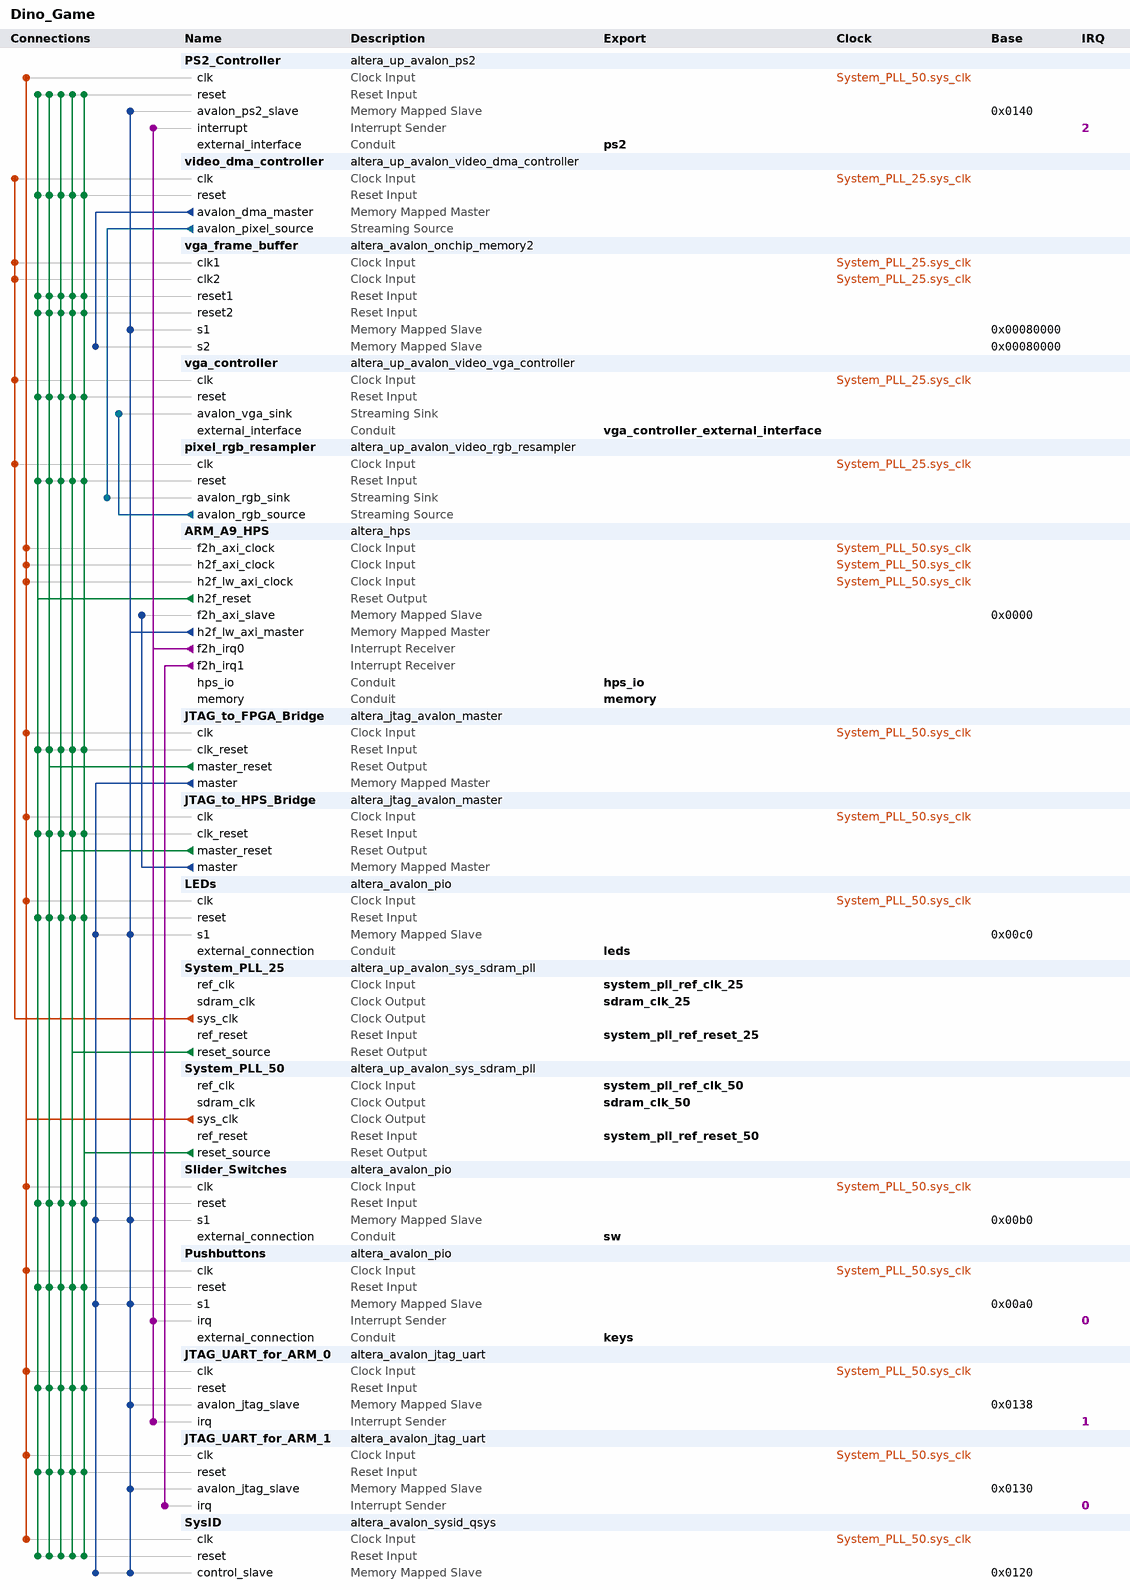
[diagram p0: system contents]
# Platform Designer (Qsys) system Dino_Game, Cyclone V 5CSEMA5F31C6
# Parameters at their usual value, and those the tool derives, are not listed.
package require -exact qsys 22.1
create_system Dino_Game
set_project_property DEVICE_FAMILY {Cyclone V}
set_project_property DEVICE 5CSEMA5F31C6

add_instance PS2_Controller altera_up_avalon_ps2 18.0

add_instance video_dma_controller altera_up_avalon_video_dma_controller 18.0
set_instance_parameter_value video_dma_controller addr_mode X-Y
set_instance_parameter_value video_dma_controller back_start_address 0
set_instance_parameter_value video_dma_controller color_bits 8
set_instance_parameter_value video_dma_controller color_planes 1
set_instance_parameter_value video_dma_controller dma_enabled true
set_instance_parameter_value video_dma_controller height 480
set_instance_parameter_value video_dma_controller mode {From Memory to Stream}
set_instance_parameter_value video_dma_controller start_address 0
set_instance_parameter_value video_dma_controller width 640

add_instance vga_frame_buffer altera_avalon_onchip_memory2 22.1
set_instance_parameter_value vga_frame_buffer dataWidth 8
set_instance_parameter_value vga_frame_buffer dualPort true
set_instance_parameter_value vga_frame_buffer initMemContent true
set_instance_parameter_value vga_frame_buffer initializationFileName vga_frame_buffer
set_instance_parameter_value vga_frame_buffer memorySize 307200

add_instance vga_controller altera_up_avalon_video_vga_controller 21.1
set_instance_parameter_value vga_controller board DE1-SoC
set_instance_parameter_value vga_controller resolution {VGA 640x480}

add_instance pixel_rgb_resampler altera_up_avalon_video_rgb_resampler 18.0
set_instance_parameter_value pixel_rgb_resampler alpha 1023
set_instance_parameter_value pixel_rgb_resampler input_type {8-bit RGB}
set_instance_parameter_value pixel_rgb_resampler output_type {30-bit RGB}

add_instance ARM_A9_HPS altera_hps 22.1
set_instance_parameter_value ARM_A9_HPS EMAC1_Mode RGMII
set_instance_parameter_value ARM_A9_HPS EMAC1_PinMuxing {HPS I/O Set 0}
set_instance_parameter_value ARM_A9_HPS F2SCLK_COLDRST_Enable false
set_instance_parameter_value ARM_A9_HPS F2SCLK_DBGRST_Enable false
set_instance_parameter_value ARM_A9_HPS F2SCLK_WARMRST_Enable false
set_instance_parameter_value ARM_A9_HPS F2SINTERRUPT_Enable true
set_instance_parameter_value ARM_A9_HPS F2S_Width 2
set_instance_parameter_value ARM_A9_HPS FPGA_PERIPHERAL_OUTPUT_CLOCK_FREQ_EMAC0_GTX_CLK 100
set_instance_parameter_value ARM_A9_HPS FPGA_PERIPHERAL_OUTPUT_CLOCK_FREQ_EMAC0_MD_CLK 100.0
set_instance_parameter_value ARM_A9_HPS FPGA_PERIPHERAL_OUTPUT_CLOCK_FREQ_EMAC1_GTX_CLK 100
set_instance_parameter_value ARM_A9_HPS FPGA_PERIPHERAL_OUTPUT_CLOCK_FREQ_EMAC1_MD_CLK 100.0
set_instance_parameter_value ARM_A9_HPS HPS_PROTOCOL DDR3
set_instance_parameter_value ARM_A9_HPS I2C0_Mode I2C
set_instance_parameter_value ARM_A9_HPS I2C0_PinMuxing {HPS I/O Set 0}
set_instance_parameter_value ARM_A9_HPS I2C1_Mode I2C
set_instance_parameter_value ARM_A9_HPS I2C1_PinMuxing {HPS I/O Set 0}
set_instance_parameter_value ARM_A9_HPS LWH2F_Enable true
set_instance_parameter_value ARM_A9_HPS MEM_BANKADDR_WIDTH 3
set_instance_parameter_value ARM_A9_HPS MEM_CLK_FREQ 400.0
set_instance_parameter_value ARM_A9_HPS MEM_COL_ADDR_WIDTH 10
set_instance_parameter_value ARM_A9_HPS MEM_DQ_WIDTH 32
set_instance_parameter_value ARM_A9_HPS MEM_DRV_STR RZQ/6
set_instance_parameter_value ARM_A9_HPS MEM_ROW_ADDR_WIDTH 15
set_instance_parameter_value ARM_A9_HPS MEM_RTT_NOM RZQ/6
set_instance_parameter_value ARM_A9_HPS MEM_RTT_WR {Dynamic ODT off}
set_instance_parameter_value ARM_A9_HPS MEM_TCL 7
set_instance_parameter_value ARM_A9_HPS MEM_TFAW_NS 45.0
set_instance_parameter_value ARM_A9_HPS MEM_TRAS_NS 36.0
set_instance_parameter_value ARM_A9_HPS MEM_TRCD_NS 13.125
set_instance_parameter_value ARM_A9_HPS MEM_TRFC_NS 300.0
set_instance_parameter_value ARM_A9_HPS MEM_TRP_NS 13.125
set_instance_parameter_value ARM_A9_HPS MEM_VENDOR Micron
set_instance_parameter_value ARM_A9_HPS MEM_WTCL 7
set_instance_parameter_value ARM_A9_HPS QSPI_Mode {1 SS}
set_instance_parameter_value ARM_A9_HPS QSPI_PinMuxing {HPS I/O Set 0}
set_instance_parameter_value ARM_A9_HPS REF_CLK_FREQ 25.0
set_instance_parameter_value ARM_A9_HPS S2FCLK_USER2CLK 5
set_instance_parameter_value ARM_A9_HPS S2F_Width 3
set_instance_parameter_value ARM_A9_HPS SDIO_Mode {4-bit Data}
set_instance_parameter_value ARM_A9_HPS SDIO_PinMuxing {HPS I/O Set 0}
set_instance_parameter_value ARM_A9_HPS SPIM1_Mode {Single Slave Select}
set_instance_parameter_value ARM_A9_HPS SPIM1_PinMuxing {HPS I/O Set 0}
set_instance_parameter_value ARM_A9_HPS STM_Enable true
set_instance_parameter_value ARM_A9_HPS TIMING_BOARD_AC_SKEW 0.02
set_instance_parameter_value ARM_A9_HPS TIMING_BOARD_AC_TO_CK_SKEW 0.01
set_instance_parameter_value ARM_A9_HPS TIMING_BOARD_DQ_TO_DQS_SKEW 0.05
set_instance_parameter_value ARM_A9_HPS TIMING_BOARD_MAX_CK_DELAY 0.03
set_instance_parameter_value ARM_A9_HPS TIMING_BOARD_MAX_DQS_DELAY 0.02
set_instance_parameter_value ARM_A9_HPS TIMING_BOARD_SKEW_BETWEEN_DQS 0.06
set_instance_parameter_value ARM_A9_HPS TIMING_BOARD_SKEW_CKDQS_DIMM_MAX 0.12
set_instance_parameter_value ARM_A9_HPS TIMING_BOARD_SKEW_CKDQS_DIMM_MIN 0.06
set_instance_parameter_value ARM_A9_HPS TIMING_BOARD_SKEW_WITHIN_DQS 0.01
set_instance_parameter_value ARM_A9_HPS TIMING_TDH 65
set_instance_parameter_value ARM_A9_HPS TIMING_TDQSCK 255
set_instance_parameter_value ARM_A9_HPS TIMING_TDQSQ 125
set_instance_parameter_value ARM_A9_HPS TIMING_TDS 30
set_instance_parameter_value ARM_A9_HPS TIMING_TIH 140
set_instance_parameter_value ARM_A9_HPS TIMING_TIS 190
set_instance_parameter_value ARM_A9_HPS TIMING_TQSH 0.4
set_instance_parameter_value ARM_A9_HPS UART0_Mode {No Flow Control}
set_instance_parameter_value ARM_A9_HPS UART0_PinMuxing {HPS I/O Set 0}
set_instance_parameter_value ARM_A9_HPS USB1_Mode SDR
set_instance_parameter_value ARM_A9_HPS USB1_PinMuxing {HPS I/O Set 0}
set_instance_parameter_value ARM_A9_HPS desired_cfg_clk_mhz 100.0
set_instance_parameter_value ARM_A9_HPS desired_qspi_clk_mhz 400.0

add_instance JTAG_to_FPGA_Bridge altera_jtag_avalon_master 22.1

add_instance JTAG_to_HPS_Bridge altera_jtag_avalon_master 22.1

add_instance LEDs altera_avalon_pio 22.1
set_instance_parameter_value LEDs direction Output
set_instance_parameter_value LEDs width 10

add_instance System_PLL_25 altera_up_avalon_sys_sdram_pll 18.0
set_instance_parameter_value System_PLL_25 CV_boards DE1-SoC
set_instance_parameter_value System_PLL_25 gui_outclk 25.0
set_instance_parameter_value System_PLL_25 gui_refclk 50.0

add_instance System_PLL_50 altera_up_avalon_sys_sdram_pll 18.0
set_instance_parameter_value System_PLL_50 CV_boards DE1-SoC
set_instance_parameter_value System_PLL_50 gui_outclk 50.0
set_instance_parameter_value System_PLL_50 gui_refclk 50.0

add_instance Slider_Switches altera_avalon_pio 22.1
set_instance_parameter_value Slider_Switches direction Input
set_instance_parameter_value Slider_Switches simDoTestBenchWiring true
set_instance_parameter_value Slider_Switches width 10

add_instance Pushbuttons altera_avalon_pio 22.1
set_instance_parameter_value Pushbuttons bitClearingEdgeCapReg true
set_instance_parameter_value Pushbuttons captureEdge true
set_instance_parameter_value Pushbuttons direction Input
set_instance_parameter_value Pushbuttons edgeType FALLING
set_instance_parameter_value Pushbuttons generateIRQ true
set_instance_parameter_value Pushbuttons irqType EDGE
set_instance_parameter_value Pushbuttons simDoTestBenchWiring true
set_instance_parameter_value Pushbuttons width 4

add_instance JTAG_UART_for_ARM_0 altera_avalon_jtag_uart 22.1
set_instance_parameter_value JTAG_UART_for_ARM_0 simInteractiveOptions NO_INTERACTIVE_WINDOWS

add_instance JTAG_UART_for_ARM_1 altera_avalon_jtag_uart 22.1
set_instance_parameter_value JTAG_UART_for_ARM_1 simInteractiveOptions NO_INTERACTIVE_WINDOWS

add_instance SysID altera_avalon_sysid_qsys 22.1
set_instance_parameter_value SysID id 0

# connections
add_connection System_PLL_25.sys_clk pixel_rgb_resampler.clk clock
add_connection System_PLL_25.sys_clk vga_controller.clk clock
add_connection System_PLL_25.sys_clk vga_frame_buffer.clk1 clock
add_connection System_PLL_25.sys_clk vga_frame_buffer.clk2 clock
add_connection System_PLL_25.sys_clk video_dma_controller.clk clock
add_connection System_PLL_50.sys_clk ARM_A9_HPS.f2h_axi_clock clock
add_connection System_PLL_50.sys_clk ARM_A9_HPS.h2f_axi_clock clock
add_connection System_PLL_50.sys_clk ARM_A9_HPS.h2f_lw_axi_clock clock
add_connection System_PLL_50.sys_clk JTAG_to_FPGA_Bridge.clk clock
add_connection System_PLL_50.sys_clk JTAG_to_HPS_Bridge.clk clock
add_connection System_PLL_50.sys_clk JTAG_UART_for_ARM_0.clk clock
add_connection System_PLL_50.sys_clk JTAG_UART_for_ARM_1.clk clock
add_connection System_PLL_50.sys_clk LEDs.clk clock
add_connection System_PLL_50.sys_clk PS2_Controller.clk clock
add_connection System_PLL_50.sys_clk Pushbuttons.clk clock
add_connection System_PLL_50.sys_clk Slider_Switches.clk clock
add_connection System_PLL_50.sys_clk SysID.clk clock
add_connection ARM_A9_HPS.h2f_reset JTAG_to_FPGA_Bridge.clk_reset reset
add_connection ARM_A9_HPS.h2f_reset JTAG_to_HPS_Bridge.clk_reset reset
add_connection ARM_A9_HPS.h2f_reset JTAG_UART_for_ARM_0.reset reset
add_connection ARM_A9_HPS.h2f_reset JTAG_UART_for_ARM_1.reset reset
add_connection ARM_A9_HPS.h2f_reset LEDs.reset reset
add_connection ARM_A9_HPS.h2f_reset pixel_rgb_resampler.reset reset
add_connection ARM_A9_HPS.h2f_reset PS2_Controller.reset reset
add_connection ARM_A9_HPS.h2f_reset Pushbuttons.reset reset
add_connection ARM_A9_HPS.h2f_reset Slider_Switches.reset reset
add_connection ARM_A9_HPS.h2f_reset SysID.reset reset
add_connection ARM_A9_HPS.h2f_reset vga_controller.reset reset
add_connection ARM_A9_HPS.h2f_reset vga_frame_buffer.reset1 reset
add_connection ARM_A9_HPS.h2f_reset vga_frame_buffer.reset2 reset
add_connection ARM_A9_HPS.h2f_reset video_dma_controller.reset reset
add_connection JTAG_to_FPGA_Bridge.master_reset JTAG_to_FPGA_Bridge.clk_reset reset
add_connection JTAG_to_FPGA_Bridge.master_reset JTAG_to_HPS_Bridge.clk_reset reset
add_connection JTAG_to_FPGA_Bridge.master_reset JTAG_UART_for_ARM_0.reset reset
add_connection JTAG_to_FPGA_Bridge.master_reset JTAG_UART_for_ARM_1.reset reset
add_connection JTAG_to_FPGA_Bridge.master_reset LEDs.reset reset
add_connection JTAG_to_FPGA_Bridge.master_reset pixel_rgb_resampler.reset reset
add_connection JTAG_to_FPGA_Bridge.master_reset PS2_Controller.reset reset
add_connection JTAG_to_FPGA_Bridge.master_reset Pushbuttons.reset reset
add_connection JTAG_to_FPGA_Bridge.master_reset Slider_Switches.reset reset
add_connection JTAG_to_FPGA_Bridge.master_reset SysID.reset reset
add_connection JTAG_to_FPGA_Bridge.master_reset vga_controller.reset reset
add_connection JTAG_to_FPGA_Bridge.master_reset vga_frame_buffer.reset1 reset
add_connection JTAG_to_FPGA_Bridge.master_reset vga_frame_buffer.reset2 reset
add_connection JTAG_to_FPGA_Bridge.master_reset video_dma_controller.reset reset
add_connection JTAG_to_HPS_Bridge.master_reset JTAG_to_FPGA_Bridge.clk_reset reset
add_connection JTAG_to_HPS_Bridge.master_reset JTAG_to_HPS_Bridge.clk_reset reset
add_connection JTAG_to_HPS_Bridge.master_reset JTAG_UART_for_ARM_0.reset reset
add_connection JTAG_to_HPS_Bridge.master_reset JTAG_UART_for_ARM_1.reset reset
add_connection JTAG_to_HPS_Bridge.master_reset LEDs.reset reset
add_connection JTAG_to_HPS_Bridge.master_reset pixel_rgb_resampler.reset reset
add_connection JTAG_to_HPS_Bridge.master_reset PS2_Controller.reset reset
add_connection JTAG_to_HPS_Bridge.master_reset Pushbuttons.reset reset
add_connection JTAG_to_HPS_Bridge.master_reset Slider_Switches.reset reset
add_connection JTAG_to_HPS_Bridge.master_reset SysID.reset reset
add_connection JTAG_to_HPS_Bridge.master_reset vga_controller.reset reset
add_connection JTAG_to_HPS_Bridge.master_reset vga_frame_buffer.reset1 reset
add_connection JTAG_to_HPS_Bridge.master_reset vga_frame_buffer.reset2 reset
add_connection JTAG_to_HPS_Bridge.master_reset video_dma_controller.reset reset
add_connection System_PLL_25.reset_source JTAG_to_FPGA_Bridge.clk_reset reset
add_connection System_PLL_25.reset_source JTAG_to_HPS_Bridge.clk_reset reset
add_connection System_PLL_25.reset_source JTAG_UART_for_ARM_0.reset reset
add_connection System_PLL_25.reset_source JTAG_UART_for_ARM_1.reset reset
add_connection System_PLL_25.reset_source LEDs.reset reset
add_connection System_PLL_25.reset_source pixel_rgb_resampler.reset reset
add_connection System_PLL_25.reset_source PS2_Controller.reset reset
add_connection System_PLL_25.reset_source Pushbuttons.reset reset
add_connection System_PLL_25.reset_source Slider_Switches.reset reset
add_connection System_PLL_25.reset_source SysID.reset reset
add_connection System_PLL_25.reset_source vga_controller.reset reset
add_connection System_PLL_25.reset_source vga_frame_buffer.reset1 reset
add_connection System_PLL_25.reset_source vga_frame_buffer.reset2 reset
add_connection System_PLL_25.reset_source video_dma_controller.reset reset
add_connection System_PLL_50.reset_source JTAG_to_FPGA_Bridge.clk_reset reset
add_connection System_PLL_50.reset_source JTAG_to_HPS_Bridge.clk_reset reset
add_connection System_PLL_50.reset_source JTAG_UART_for_ARM_0.reset reset
add_connection System_PLL_50.reset_source JTAG_UART_for_ARM_1.reset reset
add_connection System_PLL_50.reset_source LEDs.reset reset
add_connection System_PLL_50.reset_source pixel_rgb_resampler.reset reset
add_connection System_PLL_50.reset_source PS2_Controller.reset reset
add_connection System_PLL_50.reset_source Pushbuttons.reset reset
add_connection System_PLL_50.reset_source Slider_Switches.reset reset
add_connection System_PLL_50.reset_source SysID.reset reset
add_connection System_PLL_50.reset_source vga_controller.reset reset
add_connection System_PLL_50.reset_source vga_frame_buffer.reset1 reset
add_connection System_PLL_50.reset_source vga_frame_buffer.reset2 reset
add_connection System_PLL_50.reset_source video_dma_controller.reset reset
add_connection ARM_A9_HPS.h2f_lw_axi_master JTAG_UART_for_ARM_0.avalon_jtag_slave avalon
set_connection_parameter_value ARM_A9_HPS.h2f_lw_axi_master/JTAG_UART_for_ARM_0.avalon_jtag_slave baseAddress 0x0138
add_connection ARM_A9_HPS.h2f_lw_axi_master JTAG_UART_for_ARM_1.avalon_jtag_slave avalon
set_connection_parameter_value ARM_A9_HPS.h2f_lw_axi_master/JTAG_UART_for_ARM_1.avalon_jtag_slave baseAddress 0x0130
add_connection ARM_A9_HPS.h2f_lw_axi_master LEDs.s1 avalon
set_connection_parameter_value ARM_A9_HPS.h2f_lw_axi_master/LEDs.s1 baseAddress 0x00c0
add_connection ARM_A9_HPS.h2f_lw_axi_master PS2_Controller.avalon_ps2_slave avalon
set_connection_parameter_value ARM_A9_HPS.h2f_lw_axi_master/PS2_Controller.avalon_ps2_slave baseAddress 0x0140
add_connection ARM_A9_HPS.h2f_lw_axi_master Pushbuttons.s1 avalon
set_connection_parameter_value ARM_A9_HPS.h2f_lw_axi_master/Pushbuttons.s1 baseAddress 0x00a0
add_connection ARM_A9_HPS.h2f_lw_axi_master Slider_Switches.s1 avalon
set_connection_parameter_value ARM_A9_HPS.h2f_lw_axi_master/Slider_Switches.s1 baseAddress 0x00b0
add_connection ARM_A9_HPS.h2f_lw_axi_master SysID.control_slave avalon
set_connection_parameter_value ARM_A9_HPS.h2f_lw_axi_master/SysID.control_slave baseAddress 0x0120
add_connection ARM_A9_HPS.h2f_lw_axi_master vga_frame_buffer.s1 avalon
set_connection_parameter_value ARM_A9_HPS.h2f_lw_axi_master/vga_frame_buffer.s1 baseAddress 0x00080000
add_connection JTAG_to_FPGA_Bridge.master LEDs.s1 avalon
set_connection_parameter_value JTAG_to_FPGA_Bridge.master/LEDs.s1 baseAddress 0x00c0
add_connection JTAG_to_FPGA_Bridge.master Pushbuttons.s1 avalon
set_connection_parameter_value JTAG_to_FPGA_Bridge.master/Pushbuttons.s1 baseAddress 0x00a0
add_connection JTAG_to_FPGA_Bridge.master Slider_Switches.s1 avalon
set_connection_parameter_value JTAG_to_FPGA_Bridge.master/Slider_Switches.s1 baseAddress 0x00b0
add_connection JTAG_to_FPGA_Bridge.master SysID.control_slave avalon
set_connection_parameter_value JTAG_to_FPGA_Bridge.master/SysID.control_slave baseAddress 0x0120
add_connection JTAG_to_HPS_Bridge.master ARM_A9_HPS.f2h_axi_slave avalon
set_connection_parameter_value JTAG_to_HPS_Bridge.master/ARM_A9_HPS.f2h_axi_slave baseAddress 0x0000
add_connection video_dma_controller.avalon_dma_master vga_frame_buffer.s2 avalon
set_connection_parameter_value video_dma_controller.avalon_dma_master/vga_frame_buffer.s2 baseAddress 0x00080000
add_connection pixel_rgb_resampler.avalon_rgb_source vga_controller.avalon_vga_sink avalon_streaming
add_connection video_dma_controller.avalon_pixel_source pixel_rgb_resampler.avalon_rgb_sink avalon_streaming
add_connection ARM_A9_HPS.f2h_irq0 JTAG_UART_for_ARM_0.irq interrupt
set_connection_parameter_value ARM_A9_HPS.f2h_irq0/JTAG_UART_for_ARM_0.irq irqNumber 1
add_connection ARM_A9_HPS.f2h_irq0 PS2_Controller.interrupt interrupt
set_connection_parameter_value ARM_A9_HPS.f2h_irq0/PS2_Controller.interrupt irqNumber 2
add_connection ARM_A9_HPS.f2h_irq0 Pushbuttons.irq interrupt
set_connection_parameter_value ARM_A9_HPS.f2h_irq0/Pushbuttons.irq irqNumber 0
add_connection ARM_A9_HPS.f2h_irq1 JTAG_UART_for_ARM_1.irq interrupt
set_connection_parameter_value ARM_A9_HPS.f2h_irq1/JTAG_UART_for_ARM_1.irq irqNumber 0

# exported interfaces
add_interface hps_io conduit end
set_interface_property hps_io EXPORT_OF ARM_A9_HPS.hps_io
add_interface keys conduit end
set_interface_property keys EXPORT_OF Pushbuttons.external_connection
add_interface leds conduit end
set_interface_property leds EXPORT_OF LEDs.external_connection
add_interface memory conduit end
set_interface_property memory EXPORT_OF ARM_A9_HPS.memory
add_interface ps2 conduit end
set_interface_property ps2 EXPORT_OF PS2_Controller.external_interface
add_interface sdram_clk_25 clock source
set_interface_property sdram_clk_25 EXPORT_OF System_PLL_25.sdram_clk
add_interface sdram_clk_50 clock source
set_interface_property sdram_clk_50 EXPORT_OF System_PLL_50.sdram_clk
add_interface sw conduit end
set_interface_property sw EXPORT_OF Slider_Switches.external_connection
add_interface system_pll_ref_clk_25 clock sink
set_interface_property system_pll_ref_clk_25 EXPORT_OF System_PLL_25.ref_clk
add_interface system_pll_ref_clk_50 clock sink
set_interface_property system_pll_ref_clk_50 EXPORT_OF System_PLL_50.ref_clk
add_interface system_pll_ref_reset_25 reset sink
set_interface_property system_pll_ref_reset_25 EXPORT_OF System_PLL_25.ref_reset
add_interface system_pll_ref_reset_50 reset sink
set_interface_property system_pll_ref_reset_50 EXPORT_OF System_PLL_50.ref_reset
add_interface vga_controller_external_interface conduit end
set_interface_property vga_controller_external_interface EXPORT_OF vga_controller.external_interface

set_interconnect_requirement {$system} qsys_mm.clockCrossingAdapter HANDSHAKE
set_interconnect_requirement {$system} qsys_mm.enableEccProtection FALSE
set_interconnect_requirement {$system} qsys_mm.insertDefaultSlave FALSE
set_interconnect_requirement {$system} qsys_mm.maxAdditionalLatency 1

save_system Dino_Game.qsys
